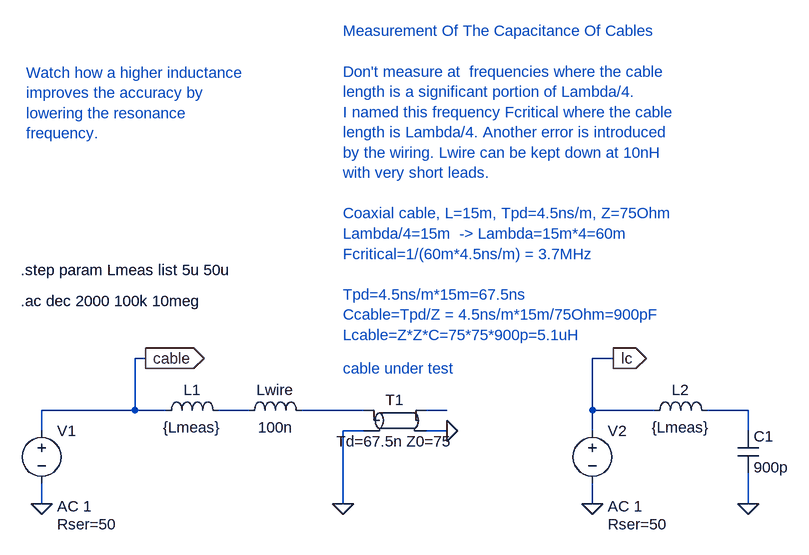
[diagram p0: schematic Cable_capacitance_measurement1.asc]
Cable_capacitance_measurement1.asc, the LTspice schematic file:
Version 4
SHEET 1 880 680
WIRE -320 176 -336 176
WIRE 400 176 368 176
WIRE -336 256 -336 176
WIRE -336 256 -480 256
WIRE -288 256 -336 256
WIRE -160 256 -208 256
WIRE 16 256 -80 256
WIRE 144 256 112 256
WIRE 368 256 368 176
WIRE 464 256 368 256
WIRE 608 256 544 256
WIRE -480 288 -480 256
WIRE 16 288 -16 288
WIRE 144 288 112 288
WIRE 368 288 368 256
WIRE 608 288 608 256
WIRE -480 400 -480 368
WIRE -16 400 -16 288
WIRE 368 400 368 368
WIRE 608 400 608 352
FLAG -16 400 0
FLAG 144 288 0
FLAG -480 400 0
FLAG 368 400 0
FLAG 608 400 0
FLAG -320 176 cable
IOPIN -320 176 Out
FLAG 400 176 lc
IOPIN 400 176 Out
SYMBOL tline 64 272 R0
SYMATTR InstName T1
SYMATTR Value Td=67.5n Z0=75
SYMBOL ind -304 272 R270
WINDOW 0 32 56 VTop 0
WINDOW 3 5 56 VBottom 0
SYMATTR InstName L1
SYMATTR Value {Lmeas}
SYMBOL voltage -480 272 R0
WINDOW 123 24 132 Left 0
WINDOW 39 24 160 Left 0
SYMATTR InstName V1
SYMATTR Value ""
SYMATTR Value2 AC 1
SYMATTR SpiceLine Rser=50
SYMBOL ind 448 272 R270
WINDOW 0 32 56 VTop 0
WINDOW 3 5 56 VBottom 0
SYMATTR InstName L2
SYMATTR Value {Lmeas}
SYMBOL voltage 368 272 R0
WINDOW 123 24 132 Left 0
WINDOW 39 24 160 Left 0
SYMATTR InstName V2
SYMATTR Value ""
SYMATTR Value2 AC 1
SYMATTR SpiceLine Rser=50
SYMBOL cap 592 288 R0
SYMATTR InstName C1
SYMATTR Value 900p
SYMBOL ind -176 272 R270
WINDOW 0 32 56 VTop 0
WINDOW 3 5 56 VBottom 0
SYMATTR InstName Lwire
SYMATTR Value 100n
TEXT -512 88 Left 0 !.ac dec 2000 100k 10meg
TEXT -16 192 Left 0 ;cable under test
TEXT -16 -328 Left 0 ;Measurement Of The Capacitance Of Cables\n \nDon't measure at  frequencies where the cable \nlength is a significant portion of Lambda/4.\nI named this frequency Fcritical where the cable \nlength is Lambda/4. Another error is introduced\nby the wiring. Lwire can be kept down at 10nH \nwith very short leads.\n \nCoaxial cable, L=15m, Tpd=4.5ns/m, Z=75Ohm\nLambda/4=15m  -> Lambda=15m*4=60m \nFcritical=1/(60m*4.5ns/m) = 3.7MHz\n \nTpd=4.5ns/m*15m=67.5ns\nCcable=Tpd/Z = 4.5ns/m*15m/75Ohm=900pF\nLcable=Z*Z*C=75*75*900p=5.1uH
TEXT -512 40 Left 0 !.step param Lmeas list 5u 50u
TEXT -504 -264 Left 0 ;Watch how a higher inductance\nimproves the accuracy by \nlowering the resonance \nfrequency.

The netlist it stands for:
* Cable_capacitance_measurement1.asc
T1 N002 0 N003 0 Td=67.5n Z0=75
L1 cable N001 {Lmeas}
V1 cable 0 AC 1 Rser=50
L2 lc N004 {Lmeas}
V2 lc 0 AC 1 Rser=50
C1 N004 0 900p
Lwire N001 N002 100n
.ac dec 2000 100k 10meg
* cable under test
* Measurement Of The Capacitance Of Cables
* Don't measure at  frequencies where the cable
* length is a significant portion of Lambda/4.
* I named this frequency Fcritical where the cable
* length is Lambda/4. Another error is introduced
* by the wiring. Lwire can be kept down at 10nH
* with very short leads.
* Coaxial cable, L=15m, Tpd=4.5ns/m, Z=75Ohm
* Lambda/4=15m  -> Lambda=15m*4=60m
* Fcritical=1/(60m*4.5ns/m) = 3.7MHz
* Tpd=4.5ns/m*15m=67.5ns
* Ccable=Tpd/Z = 4.5ns/m*15m/75Ohm=900pF
* Lcable=Z*Z*C=75*75*900p=5.1uH
.step param Lmeas list 5u 50u
* Watch how a higher inductance
* improves the accuracy by
* lowering the resonance
* frequency.
.backanno
.end